# Altium schematic sheet NG2092_TopLevel.SchDoc: =project_title
size Tabloid; CompanyName: Luxonis Holding; Organization: Luxonis Holding; Address1: 1925 Harmony Park Drive; Address2: Westminster, CO; Address3: 80234; Address4: United States; SheetNumber: 2; SheetTotal: 12
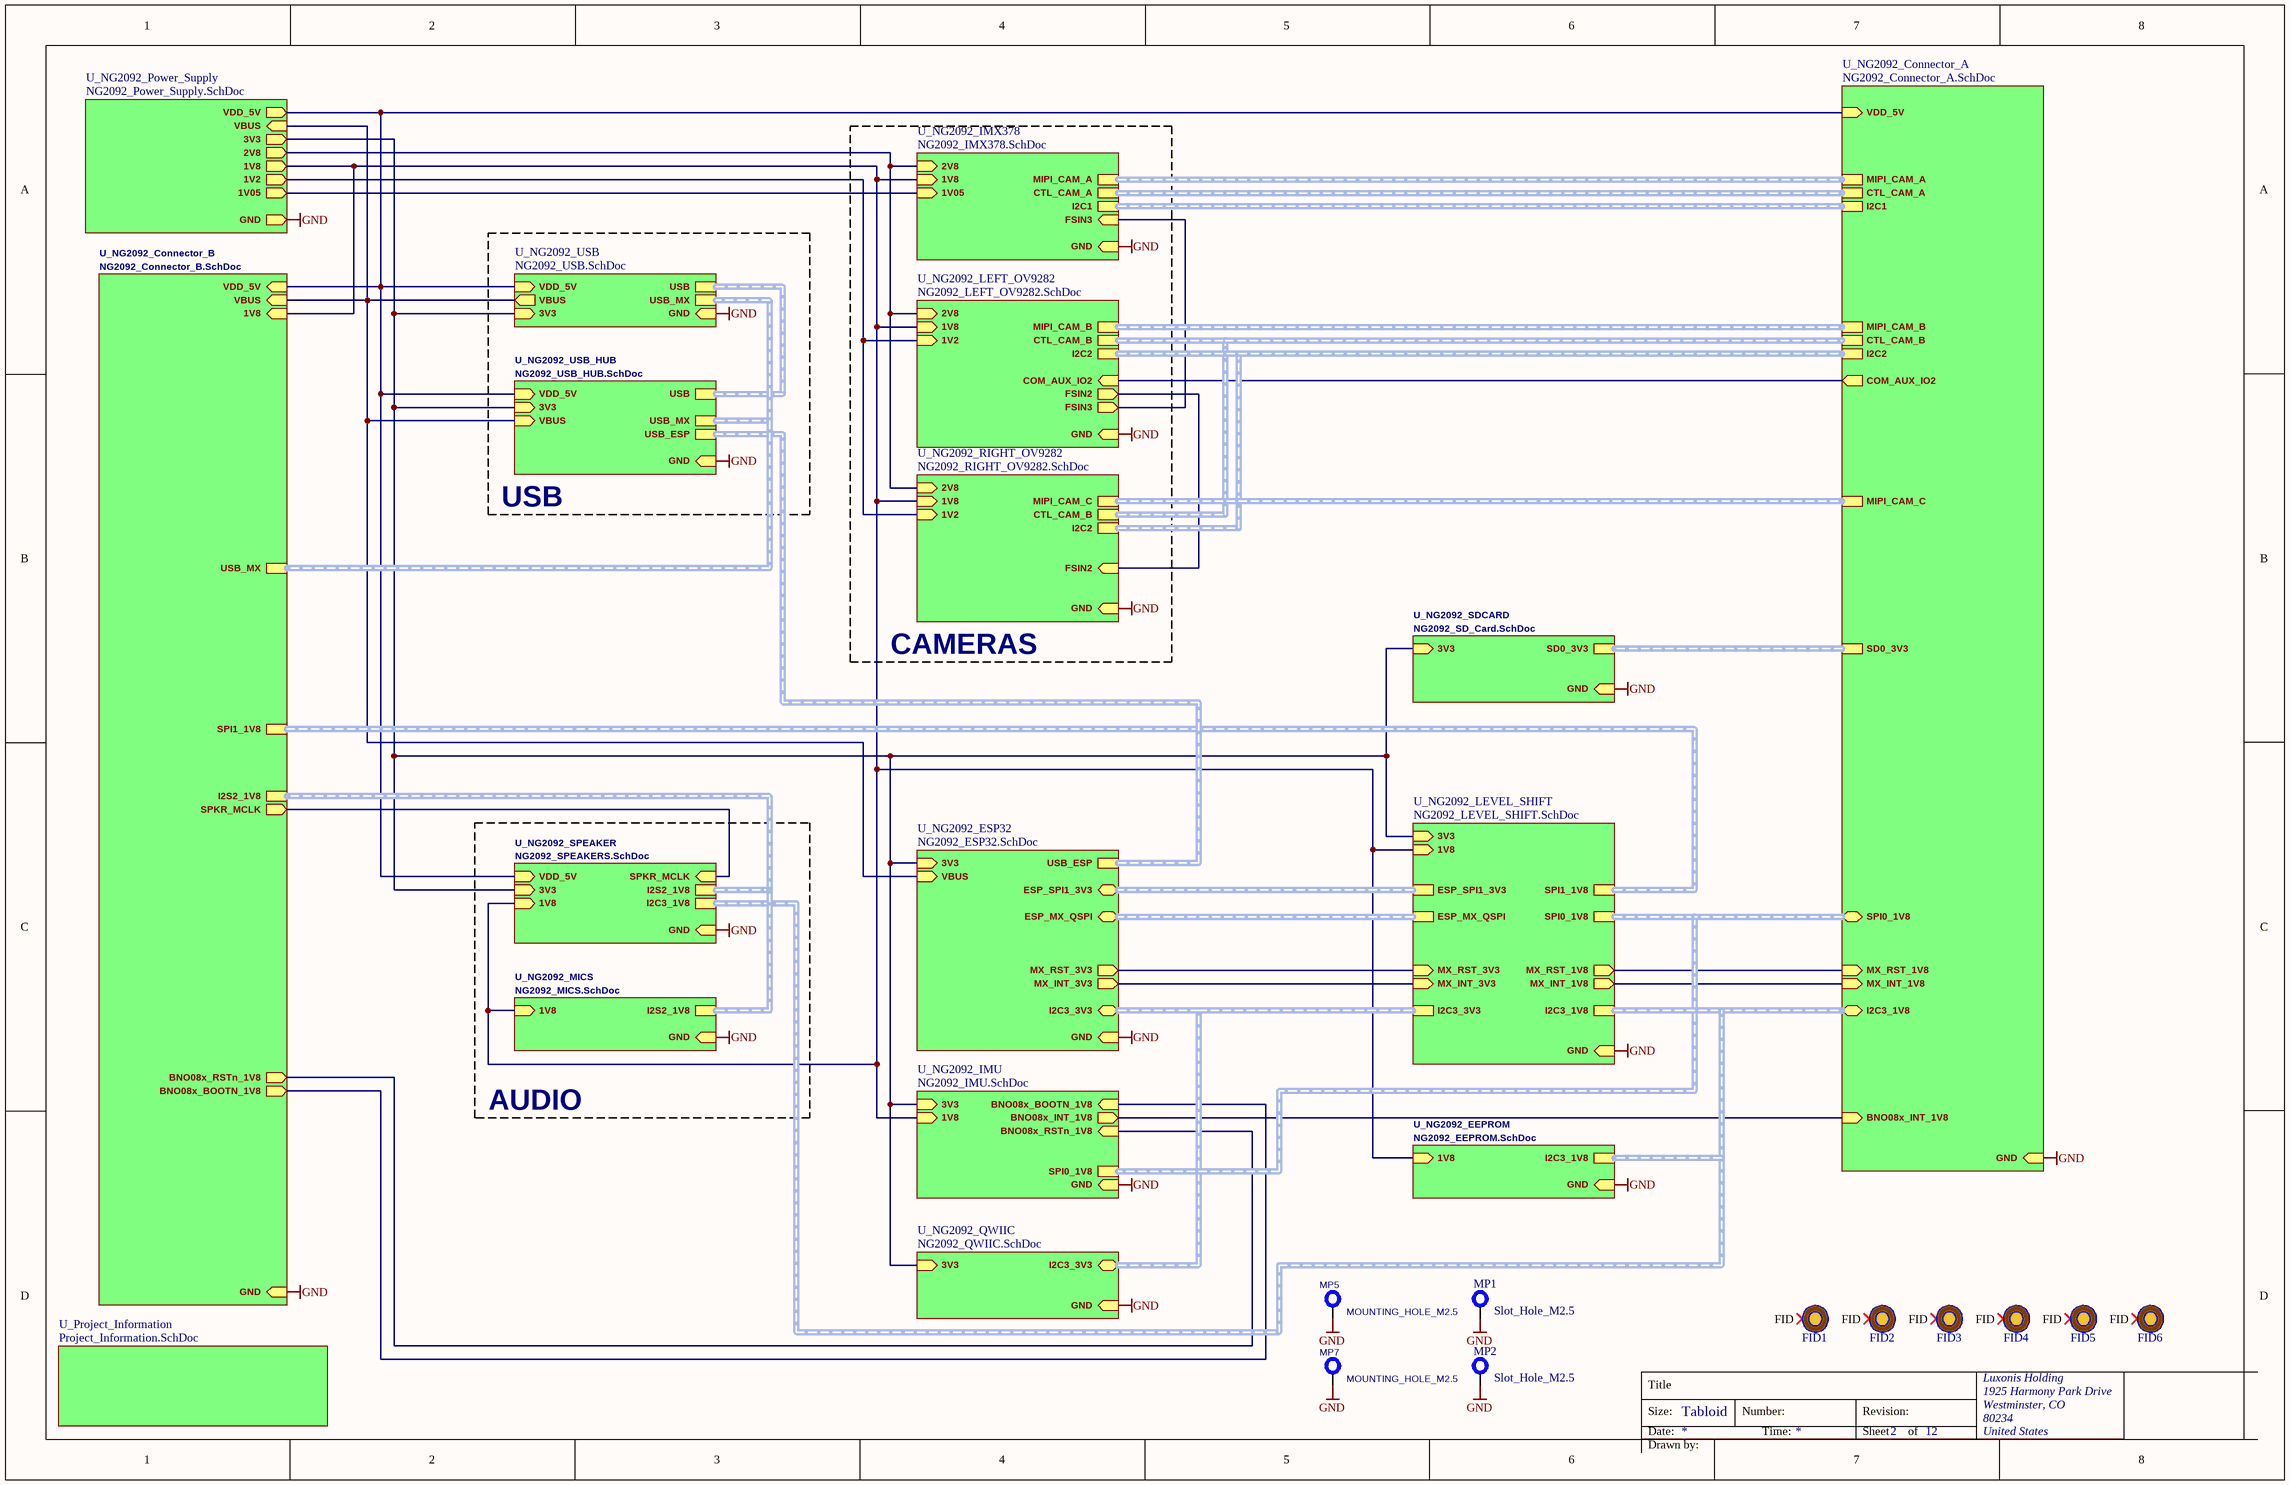
[diagram p0: NG2092_TopLevel.SchDoc]

## Parts
FID1  FIDUCIAL_ROUND_1MM  [FIDUCIAL_ROUND_1MM]  (value not drawn)  (no BOM)
FID2  FIDUCIAL_ROUND_1MM  [FIDUCIAL_ROUND_1MM]  (value not drawn)  (no BOM)
FID3  FIDUCIAL_ROUND_1MM  [FIDUCIAL_ROUND_1MM]  (value not drawn)  (no BOM)
FID4  FIDUCIAL_ROUND_1MM  [FIDUCIAL_ROUND_1MM]  (value not drawn)  (no BOM)
FID5  FIDUCIAL_ROUND_1MM  [FIDUCIAL_ROUND_1MM]  (value not drawn)  (no BOM)
FID6  FIDUCIAL_ROUND_1MM  [FIDUCIAL_ROUND_1MM]  (value not drawn)  (no BOM)
MP1  Slot_Hole_M2.5  [Slot_Hole_M2.5]  (no BOM)
MP2  Slot_Hole_M2.5  [Slot_Hole_M2.5]  (no BOM)
MP5  MOUNTING_HOLE_M2.5  [MOUNTING_HOLE_M2.5]  (no BOM)
MP7  MOUNTING_HOLE_M2.5  [MOUNTING_HOLE_M2.5]  (no BOM)

## Sub-sheets
U_NG2092_Connector_A = NG2092_Connector_A.SchDoc: MIPI_CAM_B (harness MIPI_CAM_B), MIPI_CAM_A (harness MIPI_CAM_A), MIPI_CAM_C (harness MIPI_CAM_C), I2C2 (harness I2C2), I2C1 (harness I2C1), CTL_CAM_A (harness CTL_CAM_A), CTL_CAM_B (harness CTL_CAM_B), VDD_5V (in), GND (in), COM_AUX_IO2 (out), BNO08x_INT_1V8 (in), SPI0_1V8 (bidir, harness SP0_1V8), I2C3_1V8 (bidir, harness I2C3_1V8), MX_INT_1V8 (in), MX_RST_1V8 (in), SD0_3V3 (harness SD0_3V3)
U_NG2092_Connector_B = NG2092_Connector_B.SchDoc: VDD_5V (in), I2S2_1V8 (harness I2S2_1V8), GND (in), VBUS (in), SPI1_1V8 (harness SPI1_1V8), SPKR_MCLK (out), BNO08x_RSTn_1V8 (out), BNO08x_BOOTN_1V8 (out), USB_MX (harness USB_MX), 1V8 (in)
U_NG2092_EEPROM = NG2092_EEPROM.SchDoc: I2C3_1V8 (harness I2C3_1V8), 1V8 (in), GND (in)
U_NG2092_ESP32 = NG2092_ESP32.SchDoc: GND (in), 3V3 (in), MX_RST_3V3 (out), MX_INT_3V3 (out), I2C3_3V3 (bidir, harness I2C3_3V3), ESP_SPI1_3V3 (bidir, harness ESP_SPI1_3V3), ESP_MX_QSPI (bidir, harness ESP_MX_QSPI_3V3), USB_ESP (harness USB_ESP), VBUS (in)
U_NG2092_IMU = NG2092_IMU.SchDoc: BNO08x_BOOTN_1V8 (in), GND (in), 3V3 (in), BNO08x_INT_1V8 (out), BNO08x_RSTn_1V8 (in), SPI0_1V8 (harness SPI0_1V8), 1V8 (in)
U_NG2092_IMX378 = NG2092_IMX378.SchDoc: 2V8 (in), 1V05 (in), I2C1 (harness I2C1), MIPI_CAM_A (harness MIPI_CAM_A), CTL_CAM_A (harness CTL_CAM_A), GND (in), 1V8 (in), FSIN3 (in)
U_NG2092_LEFT_OV9282 = NG2092_LEFT_OV9282.SchDoc: I2C2 (harness I2C2), CTL_CAM_B (harness CTL_CAM_B), MIPI_CAM_B (harness MIPI_CAM_B), 1V2 (in), 2V8 (in), GND (in), 1V8 (in), FSIN2 (out), COM_AUX_IO2 (in), FSIN3 (out)
U_NG2092_LEVEL_SHIFT = NG2092_LEVEL_SHIFT.SchDoc: GND (in), 3V3 (in), 1V8 (in), I2C3_3V3 (harness I2C3_3V3), I2C3_1V8 (harness I2C3_1V8), MX_INT_3V3 (in), MX_INT_1V8 (out), MX_RST_1V8 (out), MX_RST_3V3 (in), SPI0_1V8 (harness SPI0_1V8), ESP_MX_QSPI (harness ESP_MX_QSPI_3V3), ESP_SPI1_3V3 (harness ESP_SPI1_3V3), SPI1_1V8 (harness SPI1_1V8)
U_NG2092_MICS = NG2092_MICS.SchDoc: I2S2_1V8 (harness I2S2_1V8), 1V8 (in), GND (in)
U_NG2092_Power_Supply = NG2092_Power_Supply.SchDoc: 1V2 (out), 2V8 (out), GND (out), 1V8 (out), VDD_5V (out), VBUS (in), 3V3 (out), 1V05 (out)
U_NG2092_QWIIC = NG2092_QWIIC.SchDoc: GND (in), 3V3 (in), I2C3_3V3 (bidir, harness I2C3_3V3)
U_NG2092_RIGHT_OV9282 = NG2092_RIGHT_OV9282.SchDoc: MIPI_CAM_C (harness MIPI_CAM_C), I2C2 (harness I2C2), 1V2 (in), 2V8 (in), GND (in), 1V8 (in), FSIN2 (in), CTL_CAM_B (harness CTL_CAM_B)
U_NG2092_SDCARD = NG2092_SD_Card.SchDoc: GND (in), 3V3 (in), SD0_3V3 (harness SD0_3V3)
U_NG2092_SPEAKER = NG2092_SPEAKERS.SchDoc: SPKR_MCLK (in), 3V3 (in), VDD_5V (in), GND (in), I2C3_1V8 (harness I2C3_1V8), I2S2_1V8 (harness I2S2_1V8), 1V8 (in)
U_NG2092_USB = NG2092_USB.SchDoc: USB (harness USB), VBUS (out), GND (in), 3V3 (in), VDD_5V (in), USB_MX (harness USB_MX)
U_NG2092_USB_HUB = NG2092_USB_HUB.SchDoc: USB_MX (harness USB_MX), USB (harness USB), USB_ESP (harness USB_ESP), VDD_5V (in), 3V3 (in), GND (in), VBUS (in)
U_Project_Information = Project_Information.SchDoc: no entries

## Nets
GND: MP1.1 MP2.1 MP5.1 MP7.1 ; sheet U_NG2092_Power_Supply/GND, sheet U_NG2092_Connector_A/GND, sheet U_NG2092_IMX378/GND, sheet U_NG2092_RIGHT_OV9282/GND, sheet U_NG2092_LEFT_OV9282/GND, sheet U_NG2092_USB/GND, sheet U_NG2092_ESP32/GND, sheet U_NG2092_IMU/GND, sheet U_NG2092_QWIIC/GND, sheet U_NG2092_LEVEL_SHIFT/GND, sheet U_NG2092_Connector_B/GND, sheet U_NG2092_MICS/GND, sheet U_NG2092_USB_HUB/GND, sheet U_NG2092_SDCARD/GND, sheet U_NG2092_SPEAKER/GND, sheet U_NG2092_EEPROM/GND
(unnamed): sheet U_NG2092_Power_Supply/1V2, sheet U_NG2092_RIGHT_OV9282/1V2, sheet U_NG2092_LEFT_OV9282/1V2
(unnamed): sheet U_NG2092_Power_Supply/2V8, sheet U_NG2092_IMX378/2V8, sheet U_NG2092_RIGHT_OV9282/2V8, sheet U_NG2092_LEFT_OV9282/2V8
(unnamed): sheet U_NG2092_Power_Supply/1V8, sheet U_NG2092_IMX378/1V8, sheet U_NG2092_RIGHT_OV9282/1V8, sheet U_NG2092_LEFT_OV9282/1V8, sheet U_NG2092_IMU/1V8, sheet U_NG2092_LEVEL_SHIFT/1V8, sheet U_NG2092_Connector_B/1V8, sheet U_NG2092_MICS/1V8, sheet U_NG2092_SPEAKER/1V8, sheet U_NG2092_EEPROM/1V8
(unnamed): sheet U_NG2092_Power_Supply/VDD_5V, sheet U_NG2092_Connector_A/VDD_5V, sheet U_NG2092_USB/VDD_5V, sheet U_NG2092_Connector_B/VDD_5V, sheet U_NG2092_USB_HUB/VDD_5V, sheet U_NG2092_SPEAKER/VDD_5V
(unnamed): sheet U_NG2092_Power_Supply/VBUS, sheet U_NG2092_USB/VBUS, sheet U_NG2092_ESP32/VBUS, sheet U_NG2092_Connector_B/VBUS, sheet U_NG2092_USB_HUB/VBUS
(unnamed): sheet U_NG2092_Power_Supply/3V3, sheet U_NG2092_USB/3V3, sheet U_NG2092_ESP32/3V3, sheet U_NG2092_IMU/3V3, sheet U_NG2092_QWIIC/3V3, sheet U_NG2092_LEVEL_SHIFT/3V3, sheet U_NG2092_USB_HUB/3V3, sheet U_NG2092_SDCARD/3V3, sheet U_NG2092_SPEAKER/3V3
(unnamed): sheet U_NG2092_Power_Supply/1V05, sheet U_NG2092_IMX378/1V05
(unnamed): sheet U_NG2092_Connector_A/COM_AUX_IO2, sheet U_NG2092_LEFT_OV9282/COM_AUX_IO2
(unnamed): sheet U_NG2092_Connector_A/BNO08x_INT_1V8, sheet U_NG2092_IMU/BNO08x_INT_1V8
(unnamed): sheet U_NG2092_Connector_A/MX_INT_1V8, sheet U_NG2092_LEVEL_SHIFT/MX_INT_1V8
(unnamed): sheet U_NG2092_Connector_A/MX_RST_1V8, sheet U_NG2092_LEVEL_SHIFT/MX_RST_1V8
(unnamed): sheet U_NG2092_IMX378/FSIN3, sheet U_NG2092_LEFT_OV9282/FSIN3
(unnamed): sheet U_NG2092_RIGHT_OV9282/FSIN2, sheet U_NG2092_LEFT_OV9282/FSIN2
(unnamed): sheet U_NG2092_ESP32/MX_RST_3V3, sheet U_NG2092_LEVEL_SHIFT/MX_RST_3V3
(unnamed): sheet U_NG2092_ESP32/MX_INT_3V3, sheet U_NG2092_LEVEL_SHIFT/MX_INT_3V3
(unnamed): sheet U_NG2092_IMU/BNO08x_BOOTN_1V8, sheet U_NG2092_Connector_B/BNO08x_BOOTN_1V8
(unnamed): sheet U_NG2092_IMU/BNO08x_RSTn_1V8, sheet U_NG2092_Connector_B/BNO08x_RSTn_1V8
(unnamed): sheet U_NG2092_Connector_B/SPKR_MCLK, sheet U_NG2092_SPEAKER/SPKR_MCLK

Not connected (* = marked no-connect by the designer): FID1 FID*; FID2 FID*; FID3 FID*; FID4 FID*; FID5 FID*; FID6 FID*

## Buses and harness runs
harness sheet U_NG2092_Connector_A/CTL_CAM_A = sheet U_NG2092_IMX378/CTL_CAM_A
harness sheet U_NG2092_Connector_A/CTL_CAM_B = sheet U_NG2092_LEFT_OV9282/CTL_CAM_B = sheet U_NG2092_RIGHT_OV9282/CTL_CAM_B
harness sheet U_NG2092_Connector_A/I2C1 = sheet U_NG2092_IMX378/I2C1
harness sheet U_NG2092_Connector_A/I2C2 = sheet U_NG2092_LEFT_OV9282/I2C2 = sheet U_NG2092_RIGHT_OV9282/I2C2
harness sheet U_NG2092_Connector_A/I2C3_1V8 = sheet U_NG2092_EEPROM/I2C3_1V8 = sheet U_NG2092_LEVEL_SHIFT/I2C3_1V8 = sheet U_NG2092_SPEAKER/I2C3_1V8
harness sheet U_NG2092_Connector_A/MIPI_CAM_A = sheet U_NG2092_IMX378/MIPI_CAM_A
harness sheet U_NG2092_Connector_A/MIPI_CAM_B = sheet U_NG2092_LEFT_OV9282/MIPI_CAM_B
harness sheet U_NG2092_Connector_A/MIPI_CAM_C = sheet U_NG2092_RIGHT_OV9282/MIPI_CAM_C
harness sheet U_NG2092_Connector_A/SD0_3V3 = sheet U_NG2092_SDCARD/SD0_3V3
harness sheet U_NG2092_Connector_A/SPI0_1V8 = sheet U_NG2092_IMU/SPI0_1V8 = sheet U_NG2092_LEVEL_SHIFT/SPI0_1V8
harness sheet U_NG2092_Connector_B/I2S2_1V8 = sheet U_NG2092_MICS/I2S2_1V8 = sheet U_NG2092_SPEAKER/I2S2_1V8
harness sheet U_NG2092_Connector_B/SPI1_1V8 = sheet U_NG2092_LEVEL_SHIFT/SPI1_1V8
harness sheet U_NG2092_Connector_B/USB_MX = sheet U_NG2092_USB/USB_MX = sheet U_NG2092_USB_HUB/USB_MX
harness sheet U_NG2092_ESP32/ESP_MX_QSPI = sheet U_NG2092_LEVEL_SHIFT/ESP_MX_QSPI
harness sheet U_NG2092_ESP32/ESP_SPI1_3V3 = sheet U_NG2092_LEVEL_SHIFT/ESP_SPI1_3V3
harness sheet U_NG2092_ESP32/I2C3_3V3 = sheet U_NG2092_LEVEL_SHIFT/I2C3_3V3 = sheet U_NG2092_QWIIC/I2C3_3V3
harness sheet U_NG2092_ESP32/USB_ESP = sheet U_NG2092_USB_HUB/USB_ESP
harness sheet U_NG2092_USB/USB = sheet U_NG2092_USB_HUB/USB

## Notes on the sheet
- USB
- CAMERAS
- AUDIO
- Title
- Size:
- Date:
- Tabloid
- Number:
- Time:
- Revision:
- Sheet
- of
- Drawn by:

## Library data of the parts
FID1-FID6 = FIDUCIAL: Fiducial with various available footprints
MP1 MP2 = MP_Slot-Holes: =CurrentFootprint; B - Value: Not a Part; A - Level: 0
MP5 MP7 = MP_Mounting-Holes: =CurrentFootprint; B - Value: Not a Part; A - Level: 0